# Altium project 单片机控制流水灯电路.PrjPcb
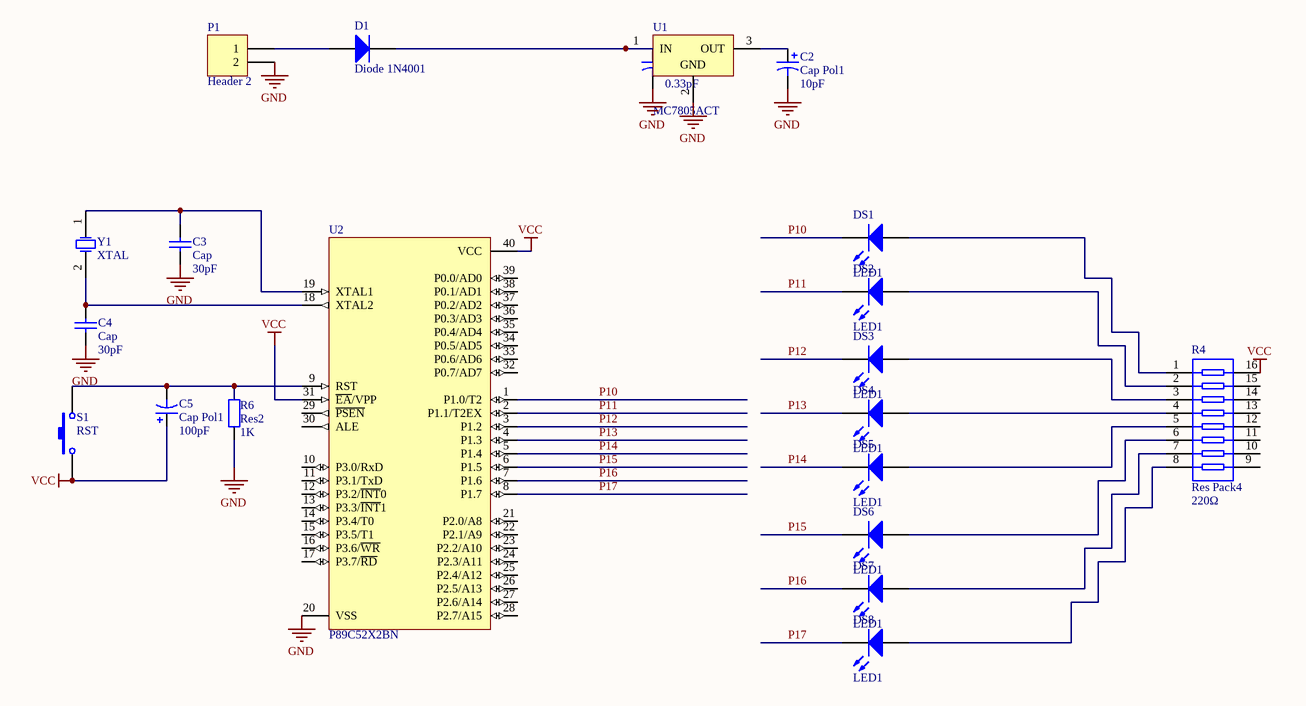
[diagram p0: 单片机控制流水灯电路.SchDoc]
1 sheet, 21 parts. Net scope: global (net labels, ports and power ports of the same name join across sheets).
Board file: PCB单片机控制流水灯电路 .PcbDoc

## Sheet 单片机控制流水灯电路.SchDoc
size A4

### Parts
C1  Cap Pol1  value 0.33pF  [RB7.6-15]
C2  Cap Pol1  value 10pF  [RB7.6-15]
C3  Cap  value 30pF  [RAD-0.3]
C4  Cap  value 30pF  [RAD-0.3]
C5  Cap Pol1  value 100pF  [RB7.6-15]
D1  Diode 1N4001  [DO-41]
DS1  LED1  [LED-1]
DS2  LED1  [LED-1]
DS3  LED1  [LED-1]
DS4  LED1  [LED-1]
DS5  LED1  [LED-1]
DS6  LED1  [LED-1]
DS7  LED1  [LED-1]
DS8  LED1  [LED-1]
P1  Header 2  [HDR1X2]
R4  Res Pack4  value 220Ω  [SSOP16_N]
R6  Res2  value 1K  [AXIAL-0.4]
S1  RST  [SPST-2]
U1  MC7805ACT  [221A-04]
U2  P89C52X2BN  [SOT129-1]
Y1  XTAL  [R38]

### Nets
GND: C1.2 C2.2 C3.1 C4.1 P1.2 R6.1 U1.2(GND) U2.20(VSS)
VCC: C5.1 R4.16 S1.1 U2.31(~{EA}/VPP) U2.40(VCC)
P10: DS1.2(K) U2.1(P1.0/T2)
P11: DS2.2(K) U2.2(P1.1/T2EX)
P12: DS3.2(K) U2.3(P1.2)
P13: DS4.2(K) U2.4(P1.3)
P14: DS5.2(K) U2.5(P1.4)
P15: DS6.2(K) U2.6(P1.5)
P16: DS7.2(K) U2.7(P1.6)
P17: DS8.2(K) U2.8(P1.7)
NetC1_1: C1.1 D1.2(K) U1.1(IN)
NetC2_1: C2.1 U1.3(OUT)
NetC3_2: C3.2 U2.19(XTAL1) Y1.1(OSC1)
NetC4_2: C4.2 U2.18(XTAL2) Y1.2(OSC2)
NetC5_2: C5.2 R6.2 S1.2 U2.9(RST)
NetD1_1: D1.1(A) P1.1
NetDS1_1: DS1.1(A) R4.1
NetDS2_1: DS2.1(A) R4.2
NetDS3_1: DS3.1(A) R4.3
NetDS4_1: DS4.1(A) R4.4
NetDS5_1: DS5.1(A) R4.5
NetDS6_1: DS6.1(A) R4.6
NetDS7_1: DS7.1(A) R4.7
NetDS8_1: DS8.1(A) R4.8

Not connected (* = marked no-connect by the designer): R4 9 10 11 12 13 14 15; U2 10(P3.0/RxD) 11(P3.1/TxD) 12(P3.2/~{INT}0) 13(P3.3/~{INT}1) 14(P3.4/T0) 15(P3.5/T1) 16(P3.6/~{WR}) 17(P3.7/~{RD}) 21(P2.0/A8) 22(P2.1/A9) 23(P2.2/A10) 24(P2.3/A11) 25(P2.4/A12) 26(P2.5/A13) 27(P2.6/A14) 28(P2.7/A15) 29(~{PSEN}) 30(ALE) 32(P0.7/AD7) 33(P0.6/AD6) 34(P0.5/AD5) 35(P0.4/AD4) 36(P0.3/AD3) 37(P0.2/AD2) 38(P0.1/AD1) 39(P0.0/AD0)

### Library data of the parts
C1 C2 C5 = Cap Pol1: Polarized Capacitor (Radial); Published: 8-Jun-2000; LatestRevisionDate: 17-Jul-2002; LatestRevisionNote: Re-released for DXP Platform.; PackageReference: RB7.6-15; Publisher: Altium Limited; PackageDescription: Polarized Capacitor (Radial); 2 Leads
C3 C4 = Cap: Capacitor; Published: 8-Jun-2000; LatestRevisionDate: 17-Jul-2002; LatestRevisionNote: Re-released for DXP Platform.; PackageReference: RAD-0.3; Publisher: Altium Limited; PackageDescription: Radial Cap, Thru-Hole; 2 Leads; 0.3 in Pin Spacing
D1 = Diode 1N4001: 1 Amp General Purpose Rectifier; Published: 8-Jun-2000; LatestRevisionDate: 17-Jul-2002; LatestRevisionNote: Re-released for DXP Platform.; DatasheetVersion: 1998; PackageVersion: Aug-1999; PackageReference: DO-41; Publisher: Altium Limited; PackageDescription: Diode, Axial; Body 5.2 x 2.7 mm (LxDia. max), Lead Dia. 0.86 mm (max); Code_JEDEC: DO-204-AL; ComponentLink1Description: Manufacturer Link; ComponentLink1URL: http://www.fairchildsemi.com/; ComponentLink2Description: Datasheet; ComponentLink2URL: http://www.fairchildsemi.com/ds/1N%2F1N4001.pdf
DS1-DS8 = LED1: Typical RED GaAs LED; Published: 8-Jun-2000; LatestRevisionDate: 08-Jul-2005; LatestRevisionNote: Mech Layer 1 removed.; PackageReference: LED-1; Publisher: Altium Limited; PackageDescription: LED; 2 Leads
P1 = Header 2: Header, 2-Pin; LatestRevisionDate: 17-Jul-2002; LatestRevisionNote: Re-released for DXP Platform.; Publisher: Altium Limited
R4 = Res Pack4: Isolated Resistor Network; Published: 24-Mar-1999; LatestRevisionDate: 29-May-2009; LatestRevisionNote: IPC-7351 Footprint Added.; PackageVersion: Oct-2003; PackageReference: SSOP16; Publisher: Altium Limited; PackageDescription: 16-Pin Plastic Small Outline Package 0.65 mm Pitch; Code_JEDEC: MO-150-AC; Code_IPC: SOP65P780-16
R6 = Res2: Resistor; Published: 8-Jun-2000; LatestRevisionDate: 17-Jul-2002; LatestRevisionNote: Re-released for DXP Platform.; PackageReference: AXIAL-0.4; Publisher: Altium Limited; PackageDescription: Axial Device, Thru-Hole; 2 Leads; 0.4 in Pin Spacing
S1 = SW-PB: Switch; Published: 24-Mar-1999; LatestRevisionDate: 17-Jul-2002; LatestRevisionNote: Re-released for DXP Platform.; PackageReference: SPST-2; Publisher: Altium Limited; PackageDescription: Switch; 2 Leads
U1 = MC7805ACT: 3-Terminal Positive Fixed Voltage Regulator; Note: Pin 2 is electrically connected to TAB; Published: 17-Jul-2002; DatasheetVersion: 1988; PackageReference: 221A-04; Publisher: Altium Limited; PackageDescription: TO, Thru-Hole, Vertical, Heatsink Mounted; 3 In-Line Leads; Pitch 2.54 mm; Code_JEDEC: TO-262-AA; ComponentLink1Description: Manufacturer Link; ComponentLink1URL: http://www.onsemi.com/site/products/taxonomy/0,4438,503,00.html; ComponentLink2Description: Datasheet; ComponentLink2URL: http://www.onsemi.com/pub/Collateral/MC7800-D.PDF
U2 = P89C52X2BN: 80C51 8-Bit Flash Microcontroller Family, 8 kB Flash; Published: 21-May-2003; DatasheetVersion: 5-Jun-2002; PackageVersion: Aug-2000; PackageReference: SOT129-1; Publisher: Altium Limited; PackageDescription: DIP, Plastic; 40 Leads; Row Spacing 15.24 mm; Pitch 2.54 mm; Code_JEDEC: MO-015; ComponentLink1Description: Manufacturer Link; ComponentLink1URL: http://www-us2.semiconductors.philips.com/; ComponentLink2Description: Datasheet; ComponentLink2URL: http://www.semiconductors.philips.com/acrobat/datasheets/P89C5XX2_2.pdf
Y1 = XTAL: Crystal Oscillator; Published: 8-Jun-2000; LatestRevisionDate: 17-Jul-2002; LatestRevisionNote: Re-released for DXP Platform.; PackageReference: R38; Publisher: Altium Limited; PackageDescription: Crystal, Thru-Hole; 2 Leads; Body 3.1 x 8.2 mm (Dia.xH)